# EAGLE schematic MGBC-MBL-01_1-5_2 (EAGLE 9.6.2)
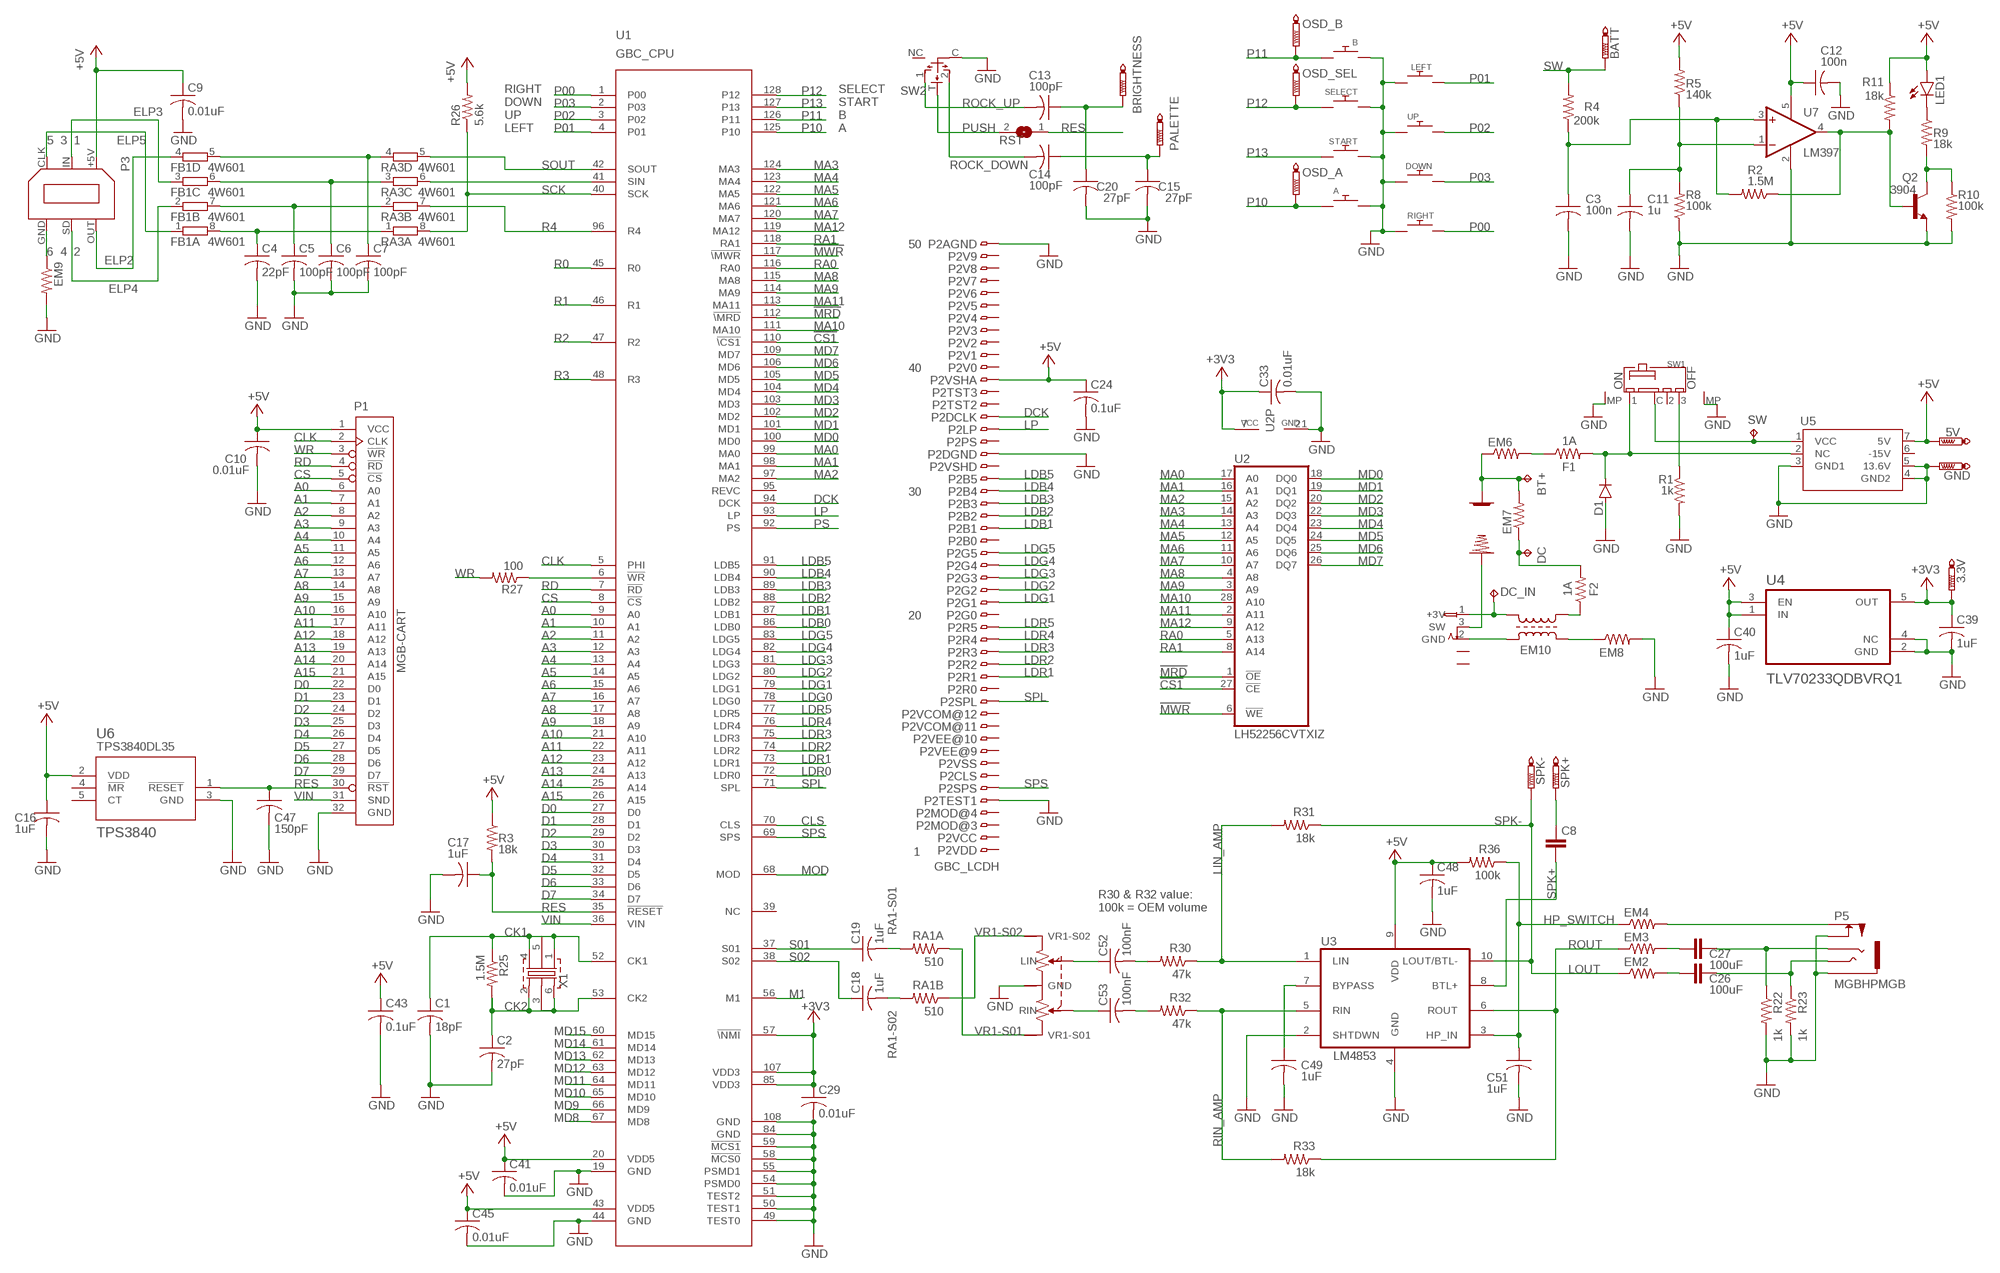
[diagram p0: schematic, sheet 1]

## Parts
3.3V  PTR1B1,27  [B1,27]
5V  PTR1B1,27  [B1,27]
+  MGB+BATTERY4  [MGB+BATTERY4]
-  MGB-BATTERY4  [MGB-BATTERY4]
A  DMG-BTN  DMG_BTN3  [DMG_BTN3]
B  DMG-BTN  DMG_BTN3  [DMG_BTN3]
BATT  PTR1TP20R  [TP20R]
BRIGHTNESS  PTR1TP20R  [TP20R]
BT+  TPPAD1-13  [P1-13]
C1  18pF  C-USC0603  [C0603]
C2  27pF  C-USC0603  [C0603]
C3  100n  C-USC0603  [C0603]
C4  22pF  C-USC0603  [C0603]
C5  100pF  C-USC0603  [C0603]
C6  100pF  C-USC0603  [C0603]
C7  100pF  C-USC0603  [C0603]
C8  C-EUC1206  [C1206]
C9  0.01uF  C-USC0603  [C0603]
C10  0.01uF  C-USC0603  [C0603]
C11  1u  C-USC0603  [C0603]
C12  100n  C-USC0603  [C0603]
C13  100pF  C-USC0603  [C0603]
C14  100pF  C-USC0603  [C0603]
C15  27pF  C-USC0603  [C0603]
C16  1uF  C-USC0603  [C0603]
C17  1uF  C-USC0603  [C0603]
C18  1uF  C-USC0603  [C0603]
C19  1uF  C-USC0603  [C0603]
C20  27pF  C-USC0603  [C0603]
C24  0.1uF  C-USC0603  [C0603]
C26  100uF  C-EUC1206  [C1206]
C27  100uF  C-EUC1206  [C1206]
C29  0.01uF  C-USC0603  [C0603]
C33  0.01uF  C-USC0603  [C0603]
C39  1uF  C-USC0603  [C0603]
C40  1uF  C-USC0603  [C0603]
C41  0.01uF  C-USC0603  [C0603]
C43  0.1uF  C-USC0603  [C0603]
C45  0.01uF  C-USC0603  [C0603]
C47  150pF  C-USC0603  [C0603]
C48  1uF  C-USC0603  [C0603]
C49  1uF  C-USC0603  [C0603]
C51  1uF  C-USC0603  [C0603]
C52  100nF  C-USC0603  [C0603]
C53  100nF  C-USC0603  [C0603]
D1  CGRM4001-G  [SOD-123_MINI-SMA]
DC  TPPAD1-13  [P1-13]
DC_IN  TPTP20R  [TP20R]
DOWN  DMG-BTN  MGB_BTN12  [MGB_BTN1_2]
EM2  BLM18BD102SN1D  R-US_R0603  [R0603]
EM3  BLM18BD102SN1D  R-US_R0603  [R0603]
EM4  BLM18BD102SN1D  R-US_R0603  [R0603]
EM6  BLM21P221SG  R-US_R0805  [R0805]
EM7  BLM21P221SG  R-US_R0805  [R0805]
EM8  BLM21P221SG  R-US_R0805  [R0805]
EM9  BLM21P221SG  R-US_R0603  [R0603]
EM10  ACM4532-801-2PA  [ACM4532]
F1  1A  R-US_R0603  [R0603]
F2  1A  R-US_R0603  [R0603]
FB1  4W601  4R-NEXB38V  [EXB38V]
GND  PTR1B1,27  [B1,27]
LED1  LED3MM  [LED3MM]
LEFT  DMG-BTN  MGB_BTN12  [MGB_BTN1_2]
OSD_A  PTR1TP20R  [TP20R]
OSD_B  PTR1TP20R  [TP20R]
OSD_SEL  PTR1TP20R  [TP20R]
P1  MGB-CART  [MGB-CART]
P2  GBC_LCDH  [FH12-50S-0.5SH]
P3  LINKPORTDMG-LINK-SHORT  LINKPORTCGB-LINK  [CGB-LINK]
P4  MGB-PWRJACK  [MGB-PWRJACK]
P5  MGBHPMGB  [MGB-HEADPHONE]
PALETTE  PTR1TP20R  [TP20R]
Q2  3904  MMBT3904LT1-NPN-SOT23-BEC  [SOT23-BEC]
R1  1k  R-US_R0603  [R0603]
R2  1.5M  R-US_R0603  [R0603]
R3  18k  R-US_R0603  [R0603]
R4  200k  R-US_R0603  [R0603]
R5  140k  R-US_R0603  [R0603]
R8  100k  R-US_R0603  [R0603]
R9  18k  R-US_R0603  [R0603]
R10  100k  R-US_R0603  [R0603]
R11  18k  R-US_R0603  [R0603]
R22  1k  R-US_R0603  [R0603]
R23  1k  R-US_R0603  [R0603]
R25  1.5M  R-US_R0603  [R0603]
R26  5.6k  R-US_R0603  [R0603]
R27  100  R-US_R0603  [R0603]
R30  47k  R-US_R0603  [R0603]
R31  18k  R-US_R0603  [R0603]
R32  47k  R-US_R0603  [R0603]
R33  18k  R-US_R0603  [R0603]
R36  100k  R-US_R0603  [R0603]
RA1A  510  R-US_R0603  [R0603]
RA1B  510  R-US_R0603  [R0603]
RA3  4W601  4R-NEXB38V  [EXB38V]
RIGHT  DMG-BTN  MGB_BTN12  [MGB_BTN1_2]
RST  SJ  [SJ]
SELECT  DMG-BTN  DMG_BTN1L  [DMG_BTN1_W2]
SPK+  PTR1PAD1-13  [P1-13]
SPK-  PTR1PAD1-13  [P1-13]
START  DMG-BTN  DMG_BTN1L  [DMG_BTN1_W2]
SW  TPTP20R  [TP20R]
SW1  MGB-SW1  [MGB-SWITCH]
SW2  NAV_SWITCH  [NAV_SWITCH]
U1  GBC_CPU  [QFP-128]
U2  LH52256CVTXIZ  [TSOP1-28]
U3  LM4853  [VSSOP10]
U4  TLV70233QDBVRQ1  [SOT95P280X145-5N]
U5  MGB-PWR_BD  [MGB-PWRBD]
U6  TPS3840  [SOT-23-5]
U7  TL331  [DBV-R-PDSO-G5]
UP  DMG-BTN  MGB_BTN12  [MGB_BTN1_2]
VR1  MGB-POT""  [MGB-POT]
X1  8.388608MHZ12SMX-B-4-PAD  [7.5X5-4-PAD]

## Nets
!CS1: U1.110(!\CS1) U2.27(!CE)
!MRD: U1.112(!\MRD) U2.1(!OE)
!MWR: U1.117(!\MWR) U2.6(!WE)
+3V3: 3.3V.TP C29.1 C33.1 C39.1 U1.57(!\NMI) U1.85(VDD3) U1.107(VDD3) U2.7(VCC) U4.5(OUT)
+5V: 5V.TP C9.1 C10.1 C12.1 C16.1 C24.1 C40.1 C41.1 C43.1 C45.1 C48.1 LED1.A P1.1(VCC) P2.39 P3.+5V R3.1 R5.2 R11.1 R26.2 R36.2 U1.20(VDD5) U1.43(VDD5) U3.9(VDD) U4.1(IN) U4.3(EN) U5.7(5V) U6.2(VDD) U7.5(V+)
A0: P1.6(A0) U1.9(A0)
A1: P1.7(A1) U1.10(A1)
A2: P1.8(A2) U1.11(A2)
A3: P1.9(A3) U1.12(A3)
A4: P1.10(A4) U1.13(A4)
A5: P1.11(A5) U1.14(A5)
A6: P1.12(A6) U1.15(A6)
A7: P1.13(A7) U1.16(A7)
A8: P1.14(A8) U1.17(A8)
A9: P1.15(A9) U1.18(A9)
A10: P1.16(A10) U1.21(A10)
A11: P1.17(A11) U1.22(A11)
A12: P1.18(A12) U1.23(A12)
A13: P1.19(A13) U1.24(A13)
A14: P1.20(A14) U1.25(A14)
A15: P1.21(A15) U1.26(A15)
BATT: +.P$1 +.P$2 +.P$3 BT+.TP EM6.1 EM7.2
CK1: C1.1 R25.1 U1.52(CK1) X1.1 X1.4 X1.5
CK2: C2.1 R25.2 U1.53(CK2) X1.2 X1.3 X1.6
CLK: P1.2(CLK) U1.5(PHI)
CLS: U1.70(CLS)
CS: P1.5(!CS) U1.8(!CS)
D0: P1.22(D0) U1.27(D0)
D1: P1.23(D1) U1.28(D1)
D2: P1.24(D2) U1.29(D2)
D3: P1.25(D3) U1.30(D3)
D4: P1.26(D4) U1.31(D4)
D5: P1.27(D5) U1.32(D5)
D6: P1.28(D6) U1.33(D6)
D7: P1.29(D7) U1.34(D7)
DCK: P2.36 U1.94(DCK)
ELP2: FB1.4 P3.OUT
ELP3: FB1.3 P3.IN
ELP4: FB1.2 P3.SD
ELP5: FB1.1 P3.CLK
EM10_GND: EM10.3 P4.2(GND)
EM10_POS: DC_IN.TP EM10.4 P4.1(+3V)
GND: A.P$2 B.P$1 C1.2 C2.2 C3.2 C4.2 C5.2 C6.2 C7.2 C9.2 C10.2 C11.2 C12.2 C15.2 C16.2 C17.2 C20.2 C24.2 C29.2 C33.2 C39.2 C40.2 C41.2 C43.2 C45.2 C47.2 C48.2 C49.2 C51.2 D1.A DOWN.P$2 EM8.2 EM9.2 GND.TP LEFT.P$2 P1.32(GND) P2.5 P2.33 P2.50 P5.GND(S) P5.SWGND(SWB) Q2.E R1.2 R8.1 R10.2 R22.2 R23.2 RIGHT.P$1 SELECT.P$1 START.P$1 SW1.P$MP1(MP1) SW1.P$MP2(MP2) SW2.C U1.19(GND) U1.44(GND) U1.49(TEST0) U1.50(TEST1) U1.51(TEST2) U1.54(PSMD0) U1.55(PSMD1) U1.58(!MCS0) U1.59(!MCS1) U1.84(GND) U1.108(GND) U2.21(GND) U3.2(SHTDWN) U3.4(GND) U4.2(GND) U4.4(NC) U5.3(GND1) U5.4(GND2) U5.5(13.6V) U6.3(GND) U7.2(GND) UP.P$1 VR1.P$1(GND)
HP_SWITCH: C51.1 EM4.1 R36.1 U3.3(HP_IN)
LDB0: U1.86(LDB0)
LDB1: P2.27 U1.87(LDB1)
LDB2: P2.28 U1.88(LDB2)
LDB3: P2.29 U1.89(LDB3)
LDB4: P2.30 U1.90(LDB4)
LDB5: P2.31 U1.91(LDB5)
LDG0: U1.78(LDG0)
LDG1: P2.21 U1.79(LDG1)
LDG2: P2.22 U1.80(LDG2)
LDG3: P2.23 U1.81(LDG3)
LDG4: P2.24 U1.82(LDG4)
LDG5: P2.25 U1.83(LDG5)
LDR0: U1.72(LDR0)
LDR1: P2.15 U1.73(LDR1)
LDR2: P2.16 U1.74(LDR2)
LDR3: P2.17 U1.75(LDR3)
LDR4: P2.18 U1.76(LDR4)
LDR5: P2.19 U1.77(LDR5)
LIN_AMP: R30.1 R31.2 U3.1(LIN)
LP: P2.35 U1.93(LP)
M1: U1.56(M1)
MA0: U1.99(MA0) U2.17(A0)
MA1: U1.98(MA1) U2.16(A1)
MA2: U1.97(MA2) U2.15(A2)
MA3: U1.124(MA3) U2.14(A3)
MA4: U1.123(MA4) U2.13(A4)
MA5: U1.122(MA5) U2.12(A5)
MA6: U1.121(MA6) U2.11(A6)
MA7: U1.120(MA7) U2.10(A7)
MA8: U1.115(MA8) U2.4(A8)
MA9: U1.114(MA9) U2.3(A9)
MA10: U1.111(MA10) U2.28(A10)
MA11: U1.113(MA11) U2.2(A11)
MA12: U1.119(MA12) U2.9(A12)
MD0: U1.100(MD0) U2.18(DQ0)
MD1: U1.101(MD1) U2.19(DQ1)
MD2: U1.102(MD2) U2.20(DQ2)
MD3: U1.103(MD3) U2.22(DQ3)
MD4: U1.104(MD4) U2.23(DQ4)
MD5: U1.105(MD5) U2.24(DQ5)
MD6: U1.106(MD6) U2.25(DQ6)
MD7: U1.109(MD7) U2.26(DQ7)
MD8: U1.67(MD8)
MD9: U1.66(MD9)
MD10: U1.65(MD10)
MD11: U1.64(MD11)
MD12: U1.63(MD12)
MD13: U1.62(MD13)
MD14: U1.61(MD14)
MD15: U1.60(MD15)
MOD: U1.68(MOD)
N$1: C7.1 FB1.5 RA3.4
N$2: C6.1 FB1.6 RA3.3
N$3: Q2.C R9.2 R10.1
N$4: C52.2 R30.2
N$5: C53.2 R32.2
N$6: C5.1 FB1.7 RA3.2
N$7: C52.1 VR1.P$3(LIN)
N$8: R27.1 U1.6(!WR)
N$9: C4.1 FB1.8 RA3.1
N$10: C53.1 VR1.P$2(RIN)
N$11: R1.1 SW1.P$3
N$12: LED1.K(C) R9.1
N$13: DC.TP EM7.1 F2.2
N$14: C3.1 R2.2 R4.1 U7.3(+IN)
N$15: D1.C F1.2 SW1.P$1 U5.2(NC)
N$16: EM6.2 F1.1
N$17: EM10.1 F2.1
N$18: RA3.6 U1.41(SIN)
N$20: EM8.1 EM10.2
N$23: BRIGHTNESS.TP C13.1 C20.1
N$24: EM9.1 P3.GND
N$25: C14.1 C15.1 PALETTE.TP
N$26: C11.1 R5.1 R8.2 U7.1(-IN)
N$29: C49.1 U3.7(BYPASS)
N$31: Q2.B R2.1 R11.2 U7.4(OUT)
N$35: EM4.2 P5.SW(SWA)
N$40: C27.2 P5.R R22.1
N$41: C26.2 P5.L(T) R23.1
N$42: C26.1 EM2.2
N$43: C27.1 EM3.2
N$44: C8.1 SPK+.TP
P00: RIGHT.P$2 U1.1(P00)
P01: LEFT.P$1 U1.4(P01)
P02: U1.3(P02) UP.P$2
P03: DOWN.P$1 U1.2(P03)
P10: A.P$1 OSD_A.TP U1.125(P10)
P11: B.P$2 OSD_B.TP U1.126(P11)
P12: OSD_SEL.TP SELECT.P$2 U1.128(P12)
P13: START.P$2 U1.127(P13)
PS: U1.92(PS)
PUSH: RST.2 SW2.T
R0: U1.45(R0)
R1: U1.46(R1)
R2: U1.47(R2)
R3: U1.48(R3)
R4: RA3.7 U1.96(R4)
RA0: U1.116(RA0) U2.5(A13)
RA1: U1.118(RA1) U2.8(A14)
RA1-S01: C19.2 RA1A.2
RA1-S02: C18.2 RA1B.2
RD: P1.4(!RD) U1.7(!RD)
RES: C17.1 C47.1 P1.30(!RST) R3.2 RST.1 U1.35(!RESET) U6.1(!RESET)
RIN_AMP: R32.1 R33.2 U3.5(RIN)
ROCK_DOWN: C14.2 SW2.2
ROCK_UP: C13.2 SW2.1
ROUT: EM3.1 R33.1 U3.6(ROUT)
S01: C19.1 U1.37(S01)
S02: C18.1 U1.38(S02)
SCK: R26.1 RA3.8 U1.40(SCK)
SOUT: RA3.5 U1.42(SOUT)
SPK+: C8.2 U3.8(BTL+)
SPK-: EM2.1 R31.1 SPK-.TP U3.10(LOUT/BTL-)
SPL: P2.13 U1.71(SPL)
SPS: P2.6 U1.69(SPS)
SW: BATT.TP R4.2 SW1.P$C(C) SW.TP U5.1(VCC)
SW1B: -.P$1 -.P$3 -.P$4 P4.3(SW)
VIN: P1.31(SND) U1.36(VIN)
VR1-S01: RA1A.1 VR1.P$5(VR1-S01)
VR1-S02: RA1B.1 VR1.P$4(VR1-S02)
WR: P1.3(!WR) R27.2
Unconnected: P2.1 P2.2 P2.3 P2.4 P2.7 P2.8 P2.9 P2.10 P2.11 P2.12 P2.14 P2.20 P2.26 P2.32 P2.34 P2.37 P2.38 P2.40 P2.41 P2.42 P2.43 P2.44 P2.45 P2.46 P2.47 P2.48 P2.49 P4.4(GND1) P4.5(GND2) SW1.P$2 SW2.NC U1.39(NC) U1.95(REVC) U6.4(!MR) U6.5(CT)

## Notes on the sheet
- RIGHT
  DOWN
  UP
  LEFT
- SELECT
  START
  B
  A
- 5  3  1
- LM397
- 50
- 6  4  2
- 40
- U5
- 30
- 20
- TPS3840DL35
- 1
- R30 & R32 value:
  100k = OEM volume
- LOUT

## Power pins joined to a net without a drawn wire
-15V: U5.6(-15V)
GND: P3.P$7(GND) P3.P$10(GND) VR1.P$6(GND) VR1.P$7(GND)

## Library data of the parts
3.3V 5V BATT BRIGHTNESS GND OSD_A OSD_B OSD_SEL PALETTE SPK+ SPK- = testpad:PTR1: TEST PIN
+ = Game Boy:MGB+BATTERY4
- = Game Boy:MGB-BATTERY4
A B = gameboy:DMG_BTN3: A, B, Up, Down, Left, Right button pads for DMG
BT+ DC DC_IN SW = testpad:TP: Test pad
C1-C7 C9-C20 C24 C29 C33 C39-C41 C43 C45 C47-C49 C51-C53 = rcl:C-US: CAPACITOR, American symbol; SPICEPREFIX: C
C8 C26 C27 = rcl:C-EU: CAPACITOR, European symbol; SPICEPREFIX: C
D1 = diode:CGRM400*-G: Molded plasitc,JEDEC SOD-123/Mini SMA Source: Comchip CGRM4001-G.pdf
DOWN LEFT RIGHT UP = gameboy:MGB_BTN1: A, B, Up, Down, Left, Right button pads for DMG
EM2-EM4 EM6-EM9 F2 R1-R5 R8-R11 R22 R23 R25-R27 R30-R33 R36 RA1A RA1B = rcl:R-US_: RESISTOR, American symbol; SPICEPREFIX: R
EM10 = gameboy:ACM4532-801-2P: TRANSFORMER SMD transformer; OC_FARNELL: unknown; OC_NEWARK: unknown
F1 = adafruit:R-US_: RESISTOR, American symbol
FB1 RA3 = resistor-dil:4R-N: Array Chip Resistor Source: RS Component / Phycomp; OC_FARNELL: unknown; OC_NEWARK: unknown
LED1 = led:LED: LED OSRAM: - CHIPLED LG R971, LG N971, LY N971, LG Q971, LY Q971, LO R971, LY R971 LH N974, LH R974 LS Q976, LO Q976, LY Q976 LO Q996 - Hyper CHIPLED LW Q18S LB Q993, LB Q99A, LB R99A - SideLED LS A670, LO A670, LY A670, LG A670, LP A670 LB A673, LV A673, LT A673, LW A673 LH A674 LY A675 LS A676, LA A676, LO A676, LY A676, LW A676 LS A679, LY A679, LG A679 - Hyper Micro SIDELED® LS Y876, LA Y876, LO Y876, LY Y876 LT Y87S - SmartLED LW L88C, LW L88S LB L89C, LB L89S, LG L890 LS L89K, LO L89K, LY L89K LS L896, LA L896, LO L896, LY L896 - TOPLED LS T670, LO T670, LY T670, LG T670, LP T670 LSG T670, LSP T670, LSY T670, LOP T670, LYG T670 LG T671, LOG T671, LSG T671 LB T673, LV T673, LT T673, LW T673 LH T674 LS T676, LA T676, LO T676, LY T676, LB T676, LH T676, LSB T676, LW T676 LB T67C, LV T67C, LT T67C, LS T67K, LO T67K, LY T67K, LW E67C LS E67B, LA E67B, LO E67B, LY E67B, LB E67C, LV E67C, LT E67C LW T67C LS T679, LY T679, LG T679 LS T770, LO T770, LY T770, LG T770, LP T770 LB T773, LV T773, LT T773, LW T773 LH T774 LS E675, LA E675, LY E675, LS T675 LS T776, LA T776, LO T776, LY T776, LB T776 LHGB T686 LT T68C, LB T68C - Hyper Mini TOPLED® LB M676 - Mini TOPLED Santana® LG M470 LS M47K, LO M47K, LY M47K Source: http://www.osram.convergy.de LUXEON: - LUMILED® LXK2-PW12-R00, LXK2-PW12-S00, LXK2-PW14-U00, LXK2-PW14-V00 LXK2-PM12-R00, LXK2-PM12-S00, LXK2-PM14-U00 LXK2-PE12-Q00, LXK2-PE12-R00, LXK2-PE12-S00, LXK2-PE14-T00, LXK2-PE14-U00 LXK2-PB12-K00, LXK2-PB12-L00, LXK2-PB12-M00, LXK2-PB14-N00, LXK2-PB14-P00, LXK2-PB14-Q00 LXK2-PR12-L00, LXK2-PR12-M00, LXK2-PR14-Q00, LXK2-PR14-R00 LXK2-PD12-Q00, LXK2-PD12-R00, LXK2-PD12-S00 LXK2-PH12-R00, LXK2-PH12-S00 LXK2-PL12-P00, LXK2-PL12-Q00, LXK2-PL12-R00 Source: www.luxeon.com KINGBRIGHT: KA-3528ASYC Source: www.kingbright.com
P1 = Game Boy:MGB-CART
P2 = gameboy:GBC_LCD: 0.5mm Pitch Connectors For FPC/FFC Source: Data sheet <http://www.hirose.co.jp/cataloge_hp/e58605370.pdf>; MPN: FH12-50S-0.5SH(55); OC_FARNELL: 1324557; OC_NEWARK: 34M6181
P3 = Game Boy:LINKPORT
P4 = Game Boy:MGB-PWRJACK
P5 = Game Boy:MGBHP
Q2 = transistor-neu-to92:*-NPN-: NPN Transistror
RST = jumper:SJ: SMD solder JUMPER
SELECT START = gameboy:DMG_BTN1: A, B, Up, Down, Left, Right button pads for DMG
SW1 = Game Boy:MGB-SW: DMG Power Switch Pins 1 and 2 are only connected when the power is ON, pins 3 and 4 are only connected when the power is OFF.
SW2 = gameboy:NAV_SWITCH: TINY SWITCH ON OFF MOM Source: http://www2.produktinfo.conrad.com/datenblaetter/700000-724999/705152-da-01-de-Subminiaturschalter_TL_36YO.pdf
U1 = gameboy:GBC_CPU: lfxp3e_tqfp144 edit this description Auto generated by make-symbol-device-package-bsdl.ulp Rev. 20 Source: lfxp3e_tqfp144.bsm
U2 = gameboy:LH52256CVT: 256K (32K x 8) CMOS-Static RAM Source: http://download.cypress.com.edgesuite.net/design_resources/datasheets/contents/cy62256_8.pdf
U3 = gameboy:LM4853: LM4853
U4 = TLV70233QDBVRQ1:TLV70233QDBVRQ1: Check availability <https://pricing.snapeda.com/parts/TLV70233QDBVRQ1/Texas%20Instruments/view-part?ref=eda>; AVAILABILITY: In Stock; DESCRIPTION: Automotive 300-mA, high-PSRR, low-IQ, low-dropout voltage regulator with enable 5-SOT-23 -40 to 125; MF: Texas Instruments; MP: TLV70233QDBVRQ1; PACKAGE: SOT-23-5 Texas Instruments; PRICE: None; PURCHASE-URL: https://pricing.snapeda.com/search/part/TLV70233QDBVRQ1/?ref=eda
U5 = Game Boy:MGB-PWR_BD
U6 = SOT95P280X145-5N:TPS3840
U7 = linear:TL331: SINGLE DIFFERENTIAL COMPARATOR Source: Data sheet <http://www.ti.com/lit/ds/symlink/tl331-q1.pdf>
VR1 = Game Boy:MGB-POT
X1 = gameboy:8.388608MHZ: CRYSTALS WITH CAN GROUNDED